# EAGLE design Nu_Module (EAGLE 6.3)
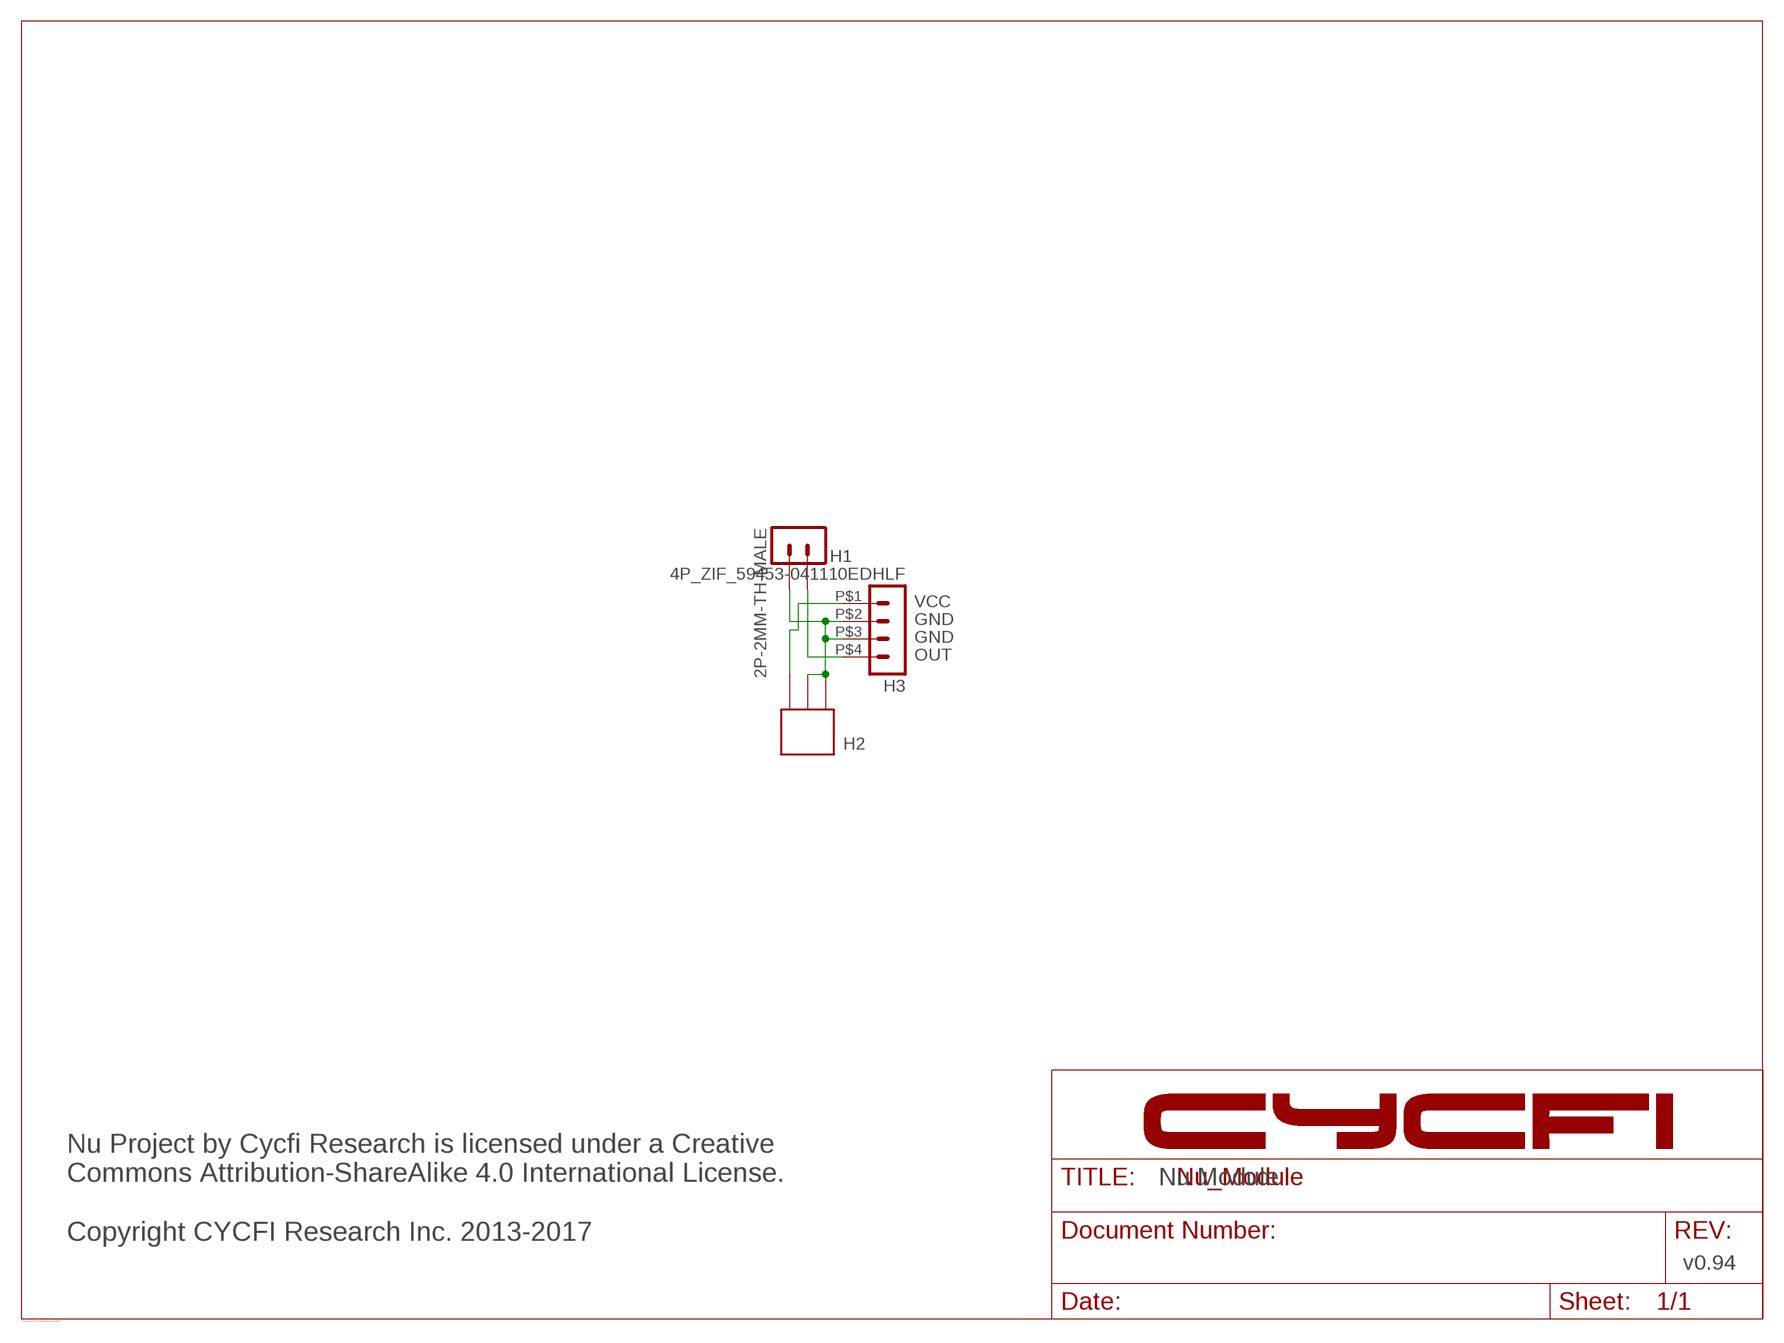
[diagram p0: schematic, sheet 1]

## Parts
H1  2P-2MM-TH-MALE  [2P-2MM-TH]
H2  951102-8622-AR  [3P-TH-2MM]
H3  4P_ZIF_59453-041110EDHLF  [4P_ZIF_59453-041110EDHLF]

## Nets
GND: H1.P$1 H2.P$1 H2.P$2 H3.P$2 H3.P$3
N$1: H1.P$2 H3.P$4
N$5: H2.P$3 H3.P$1

## Notes on the sheet
- VCC
- GND
- GND
- OUT
- H2
- Nu Module
- Nu Project by Cycfi Research is licensed under a Creative 
  Commons Attribution-ShareAlike 4.0 International License. 
  
  Copyright CYCFI Research Inc. 2013-2017
- v0.94
- C:/Users/mark belarmino/Desktop/Logo-2016.bmp

## Library data of the parts
H1 = CYCFI_Con:2P-2MM-TH-MALE
H2 = CYCFI_Con:951102-8622-AR
H3 = CYCFI_Con:4P_ZIF_59453-041110EDHLF

## Board
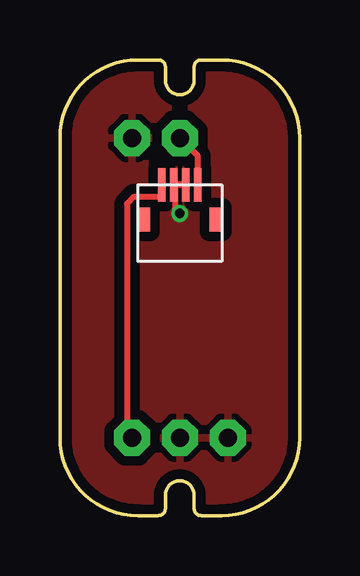
[diagram p1: board, top side]
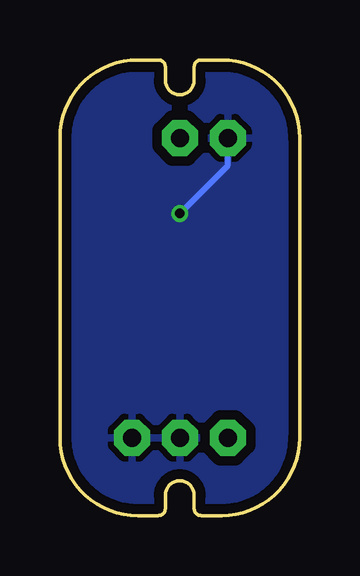
[diagram p2: board, bottom side, seen from below]

Size 10 x 19 mm. Coordinates in mm from the lower left corner, seen from the top.
Outline: 4.4,18.15 4.4,18.7 arc90 4.1,19 3.25,19 arc90 0,15.75 0,3.25 arc90 3.25,0 4.1,0 arc90 4.4,0.3 4.4,0.85 arc-90 5,1.45 arc-90 5.6,0.85 5.6,0.3 arc90 5.9,0 6.75,0 arc90 10,3.25 10,15.75 arc90 6.75,19 5.9,19 arc90 5.6,18.7 5.6,18.15 arc-90 5,17.55 arc-90 4.4,18.15
Copper layers (1*16): Top 0.035mm / dielectric 1.5mm / Bottom 0.035mm
Design rules "Fusion_eagle_rule_v1.1": minimum track width 6mil, minimum drill 12mil, track to track 6mil, track to pad 6mil, pad to pad 6mil, via to via 6mil, smd to smd 0mil, copper to edge 10mil, drill to drill 10mil, minimum pad ring 10mil, minimum via ring 6mil, stop-mask expansion 2mil, vias tented up to drill 100mil, thermal gap 10mil

### Footprints (pad centres in the part's own frame; a part is rotated, then mirrored left to right if it is on the bottom)
2P-2MM-TH = drill 0.75 pad 1.5 octagon: P$1 -1,0; P$2 1,0
3P-TH-2MM = drill 0.75 pad 1.5 octagon: P$1 -2,0; P$2 0,0; P$3 2,0
4P_ZIF_59453-041110EDHLF = smd 0.3 x 1.4: P$1 -0.75,1.5; P$2 -0.25,1.5; P$3 0.25,1.5; P$4 0.75,1.5 | smd 0.52 x 1: P$5 -1.49,0.05; P$6 1.49,0.05

### Placement (x,y rotation side)
H1  4,15.75 0 top
H2  5,3.25 180 top
H3  5,12.3 0 top

### Tracks (layer width: path | path; a pad name or v marks a point on that pad's centre or on a via)
GND  (via drill 0.4)
  Top 0.254: H3.P$3 4.8,13.8 | 4.8,13.8 H3.P$2 4.8,13.8 | 4.8,13.8 4.8,12.8 v5,12.6
  Bottom 0.254: v5,12.6 3,14.6 H1.P$1
  pour Bottom (isolate 0.406): 5,0 arc-90 0,4.5 0,14.5 arc-90 5,19 arc-90 10,14.5 10,4.5 arc-90
  pour Top (isolate 0.406): 0,14.5 0,4.5 arc90 5,0 arc90 10,4.5 10,14.5 arc90 5,19 arc90
N$1
  Top 0.254: H3.P$4 5.75,15 H1.P$2
N$5
  Top 0.254: H2.P$3 2.8,3.45 2.8,13 3.1,13.3 4.25,13.3 H3.P$1